# Altium schematic sheet PSAT_PCB.SchDoc
size A; SheetNumber: 1; SheetTotal: 1
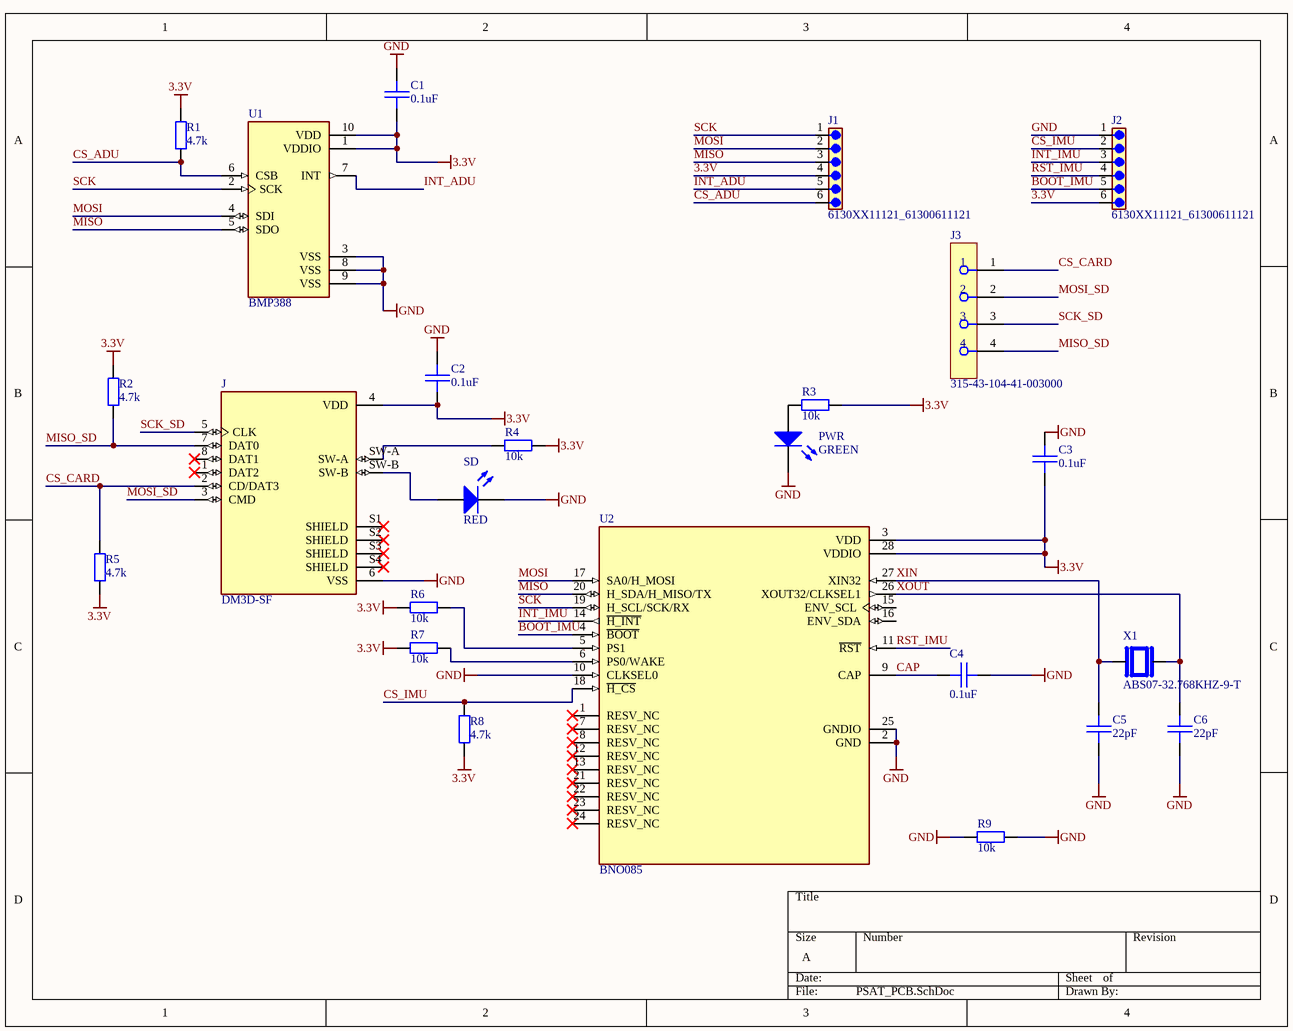
[diagram p0: PSAT_PCB.SchDoc]

## Parts
C1  0.1uF  [0805 CAP]
C2  0.1uF  [0805 CAP]
C3  0.1uF  [0805 CAP]
C4  0.1uF  [0805 CAP]
C5  22pF  [0805 CAP]
C6  22pF  [0805 CAP]
J  DM3D-SF  [HRS_DM3D-SF]
J1  6130XX11121_61300611121  [61300611121]
J2  6130XX11121_61300611121  [61300611121]
J3  315-43-104-41-003000  [FP-315-43-104-41-003000-MFG]
PWR  GREEN  [ECE-LED2012-0805SM]
R1  4.7k  [0805 RES]
R2  4.7k  [0805 RES]
R3  10k  [0805 RES]
R4  10k  [0805 RES]
R5  4.7k  [0805 RES]
R6  10k  [0805 RES]
R7  10k  [0805 RES]
R8  4.7k  [0805 RES]
R9  10k  [0805 RES]
SD  RED  [ECE-LED2012-0805SM]
U1  BMP388  [PQFN50P200X200X80-10N]
U2  BNO085  [IC_BNO085]
X1  ABS07-32.768KHZ-9-T  [XTAL_ABS07-32.768KHZ-9-T]

## Nets
3.3V: C1.2 C2.2 C3.2 J.4(VDD) J1.4 J2.6 R1.1 R2.1 R3.2 R4.2 R5.1 R6.1 R7.1 R8.1 U1.1(VDDIO) U1.10(VDD) U2.3(VDD) U2.28(VDDIO)
GND: C1.1 C2.1 C3.1 C4.1 C5.2 C6.2 J.6(VSS) J2.1 PWR.2(K) R9.1 R9.2 SD.2(K) U1.3(VSS) U1.8(VSS) U1.9(VSS) U2.2(GND) U2.10(CLKSEL0) U2.25(GNDIO)
BOOT_IMU: J2.5 U2.4(~{BOOT})
CAP: C4.2 U2.9(CAP)
CS_ADU: J1.6 R1.2 U1.6(CSB)
CS_CARD: J.2(CD/DAT3) J3.1 R5.2
CS_IMU: J2.2 R8.2 U2.18(~{H_CS})
INT_ADU: J1.5 U1.7(INT)
INT_IMU: J2.3 U2.14(~{H_INT})
MISO: J1.3 U1.5(SDO) U2.20(H_SDA/H_MISO/TX)
MISO_SD: J.7(DAT0) J3.4 R2.2
MOSI: J1.2 U1.4(SDI) U2.17(SA0/H_MOSI)
MOSI_SD: J.3(CMD) J3.2
RST_IMU: J2.4 U2.11(~{RST})
SCK: J1.1 U1.2(SCK) U2.19(H_SCL/SCK/RX)
SCK_SD: J.5(CLK) J3.3
XIN: C5.1 U2.27(XIN32) X1.1
XOUT: C6.1 U2.26(XOUT32/CLKSEL1) X1.2
NetJ_SW-A: J.SW-A R4.1
NetJ_SW-B: J.SW-B SD.1(A)
NetPWR_1: PWR.1(A) R3.1
NetR6_2: R6.2 U2.5(PS1)
NetR7_2: R7.2 U2.6(PS0/WAKE)

Not connected (* = marked no-connect by the designer): J 1(DAT2)* 8(DAT1)* S1(SHIELD)* S2(SHIELD)* S3(SHIELD)* S4(SHIELD)*; U2 1(RESV_NC)* 7(RESV_NC)* 8(RESV_NC)* 12(RESV_NC)* 13(RESV_NC)* 15(ENV_SCL) 16(ENV_SDA) 21(RESV_NC)* 22(RESV_NC)* 23(RESV_NC)* 24(RESV_NC)*

## Library data of the parts
C1-C6 = CerCap_SMT_0805: SMT ceramic capacitor 0805 size; Value: *
J = DM3D-SF: 10 _8 + 2_ Position Card Connector Secure Digital - microSDâ„¢ Surface Mount, Right Angle Gold; MF: Hirose Electric; MP: DM3D-SF; Package: None; Price: None; Availability: Unavailable; SnapEDA_Link: https://www.snapeda.com/parts/DM3D-SF/Hirose%20Electric%20Co%20Ltd/view-part/250106/?ref=snap; Value: *
J1 J2 = 6130XX11121_61300611121: MF: {'manufacturer': u'Wurth Electronics'}; Package: None; Price: None; Value: *; MP: 61300611121; Availability: Unavailable
J3 = CMP-00254-30991456-1: 315-43-104-41-003000 4 Position Receptacle Connector 0.100 (2.54mm) Through Hole Gold"; Number of Contacts: 4; Current Rating: 3A; Voltage Rating: 150V; Connector Type: Receptacle, Socket; Color: Black; Contact Material: Gold, Nickel; Contact Plating: Gold; Mount: Through Hole; RoHS: Compliant; Pitch: 2.54mm; Packaging: Bulk; Height: 2.667mm; Number of Positions: 4; Max Operating Temperature: 125°C; Min Operating Temperature: -55°C; Number of Rows: 1; Termination: Solder
PWR SD = LED-SM0805: SMT LED; Manufacturer: Generic Components; Class I: Optoelectronic; Published: 8-Jun-2000; Revision: July-2002: Re-released for DXP Platform.; Publisher: Altium Limited; Class II: LED; Value: *
R1-R9 = Res_SMT_0805: 0805 resistor; Published: 8-Jun-2000; LatestRevisionDate: 17-Jul-2002; LatestRevisionNote: Re-released for DXP Platform.; PackageReference: AXIAL-0.4; Publisher: Altium Limited; Value: *; ComponentLink1Description: https://nz.mouser.com/datasheet/2/315/AOA0000C304-1149620.pdf
U1 = BMP388: P-Sensor SPI I2C 1, 25 Bar SMD; Package: None; Price: None; Value: *; MP: BMP388; Availability: Unavailable
U2 = BNO085: Accelerometer, Gyroscope, Magnetometer, 9 Axis Sensor IÂ²C, SPI, UART Output; MF: Hillcrest Laboratories,; SnapEDA_Link: https://www.snapeda.com/parts/BNO085/Hillcrest+Laboratories%252C+Inc./view-part/?ref=snap; Package: TFLGA-28 Hillcrest Laboratories; Value: *; MP: BNO085; Check_prices: https://www.snapeda.com/parts/BNO085/Hillcrest+Laboratories%252C+Inc./view-part/?ref=eda
X1 = ABS07-32.768KHZ-9-T: 32.768 kHz Â±20ppm Crystal 9pF 70 kOhms 2-SMD, No Lead; MF: Abracon; SnapEDA_Link: https://www.snapeda.com/parts/ABS07-32.768KHZ-9-T/Abracon/view-part/?ref=snap; Package: SMD-2 Abracon LLC; Value: *; MP: ABS07-32.768KHZ-9-T; Check_prices: https://www.snapeda.com/parts/ABS07-32.768KHZ-9-T/Abracon/view-part/?ref=eda